# Altium schematic sheet BoardB-FPGA3.SchDoc
size A; SheetNumber: 5; SheetTotal: 9
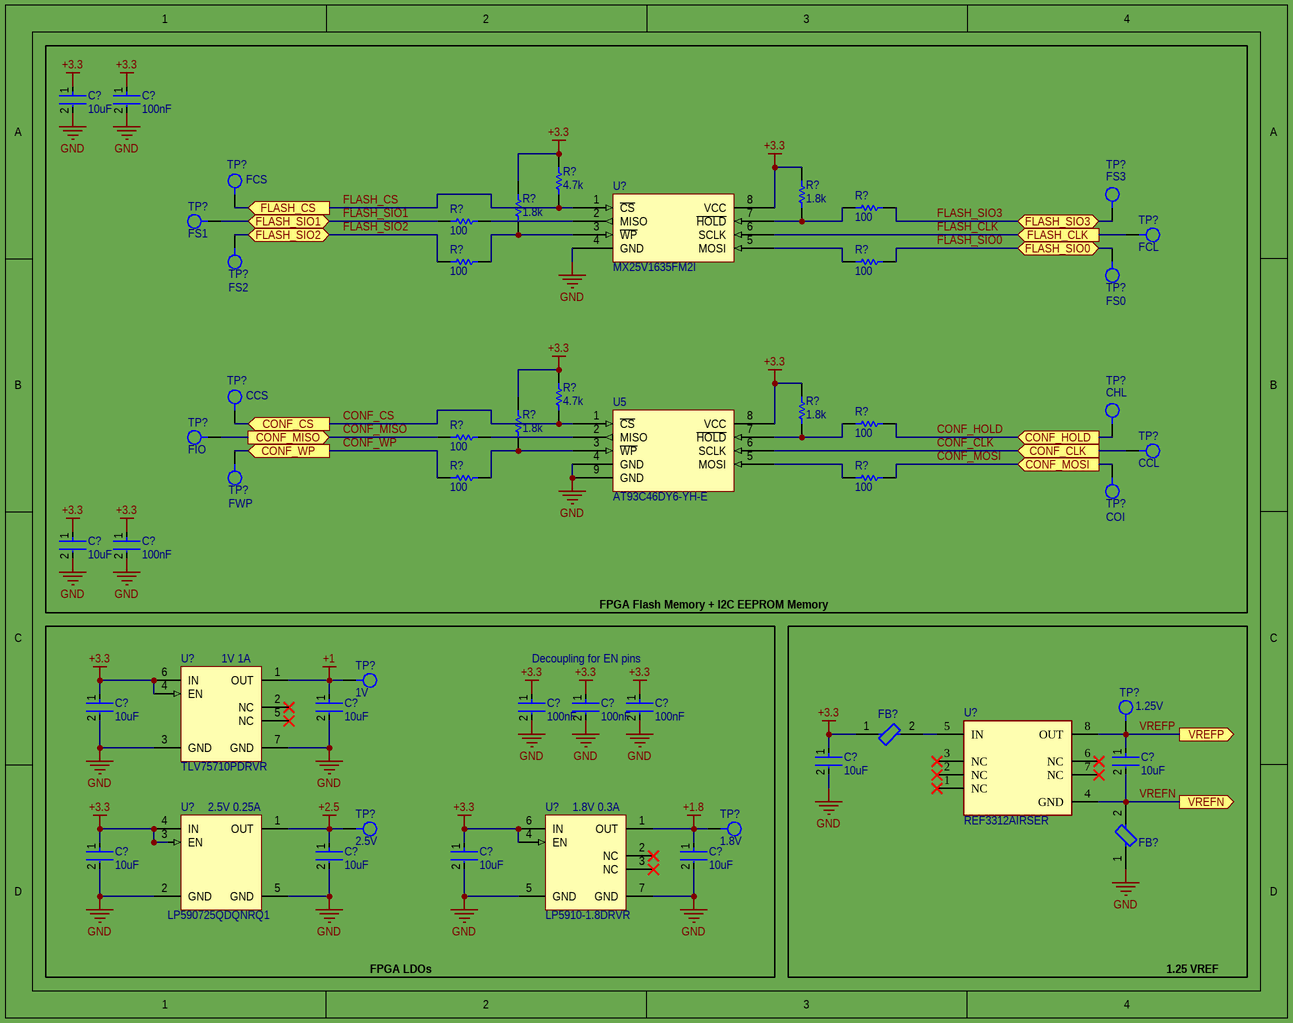
[diagram p0: BoardB-FPGA3.SchDoc]

## Parts
(Parts that share a designator on the sheet are numbered #1, #2 ... from top to bottom, then left to right.)
C?#1  10uF  [FP-GRM188-0_1-e0_2_0_55-IPC_A]
C?#2  100nF  [FP-CGA3E-0_3-0_1-IPC_A]
C?#3  10uF  [FP-GRM188-0_1-e0_2_0_55-IPC_A]
C?#4  100nF  [FP-CGA3E-0_3-0_1-IPC_A]
C?#5  10uF  [FP-GRM188-0_1-e0_2_0_55-IPC_A]
C?#6  10uF  [FP-GRM188-0_1-e0_2_0_55-IPC_A]
C?#7  100nF  [FP-CGA3E-0_3-0_1-IPC_A]
C?#8  100nF  [FP-CGA3E-0_3-0_1-IPC_A]
C?#9  100nF  [FP-CGA3E-0_3-0_1-IPC_A]
C?#10  10uF  [FP-GRM188-0_1-e0_2_0_55-IPC_A]
C?#11  10uF  [FP-GRM188-0_1-e0_2_0_55-IPC_A]
C?#12  10uF  [FP-GRM188-0_1-e0_2_0_55-IPC_A]
C?#13  10uF  [FP-GRM188-0_1-e0_2_0_55-IPC_A]
C?#14  10uF  [FP-GRM188-0_1-e0_2_0_55-IPC_A]
C?#15  10uF  [FP-GRM188-0_1-e0_2_0_55-IPC_A]
FB?#1  BLM18AG601SN1D  [FP-BLM18-0_15-t0_8-MFG]  (value not drawn)
FB?#2  BLM18AG601SN1D  [FP-BLM18-0_15-t0_8-MFG]  (value not drawn)
R?#1  4.7k  [RESC1005X40X25ML05T05]
R?#2  100  [RESC0603X26X15ML03T05]
R?#3  100  [RESC0603X26X15ML03T05]
R?#4  1.8k  [RESC1005X40X25LL05T05]
R?#5  1.8k  [RESC1005X40X25LL05T05]
R?#6  100  [RESC0603X26X15ML03T05]
R?#7  100  [RESC0603X26X15ML03T05]
R?#8  4.7k  [RESC1005X40X25ML05T05]
R?#9  100  [RESC0603X26X15ML03T05]
R?#10  100  [RESC0603X26X15ML03T05]
R?#11  1.8k  [RESC1005X40X25LL05T05]
R?#12  1.8k  [RESC1005X40X25LL05T05]
R?#13  100  [RESC0603X26X15ML03T05]
R?#14  100  [RESC0603X26X15ML03T05]
TP?#1  FCS
TP?#2  FS1
TP?#3  FS3
TP?#4  FS2
TP?#5  FCL
TP?#6  FS0
TP?#7  CCS
TP?#8  FIO
TP?#9  CHL
TP?#10  FWP
TP?#11  CCL
TP?#12  COI
TP?#13  1V
TP?#14  1.25V
TP?#15  2.5V
TP?#16  1.8V
U5  AT93C46DY6-YH-E  [AT93C46DY6-YH-E]
U?#1  MX25V1635FM2I
U?#2  TLV75710PDRVR
U?#3  REF3312AIRSER  [FP-RSE0008A-MFG]
U?#4  LP590725QDQNRQ1  [LP5907]
U?#5  LP5910-1.8DRVR  [LP5910]

## Blocks framed on the sheet
FPGA Flash Memory + I2C EEPROM Memory: C?#1-C?#4 R?#1-R?#14 TP?#1-TP?#12 U5 U?#1
1.25 VREF: C?#10 C?#11 FB?#1 FB?#2 TP?#14 U?#3

## Ports
CONF_CLK (in), CONF_CS (in), CONF_HOLD (in), CONF_MISO (out), CONF_MOSI (in), CONF_WP (in), FLASH_CLK (in), FLASH_CS (in), FLASH_SIO0 (bidir), FLASH_SIO1 (bidir), FLASH_SIO2 (bidir), FLASH_SIO3 (bidir), VREFN (out), VREFP (out)

## Nets
+1: C?#6.1 TP?#13.1 U?#2.1(OUT)
+1.8: C?#15.1 TP?#16.1 U?#5.1(OUT)
+2.5: C?#13.1 TP?#15.1 U?#4.1(OUT)
+3.3: C?#1.1 C?#2.1 C?#3.1 C?#4.1 C?#5.1 C?#7.1 C?#8.1 C?#9.1 C?#10.1 C?#12.1 C?#14.1 FB?#1.1 R?#1.2 R?#4.2 R?#5.2 R?#8.2 R?#11.2 R?#12.2 U5.8(VCC) U?#1.8(VCC) U?#2.4(EN) U?#2.6(IN) U?#4.3(EN) U?#4.4(IN) U?#5.4(EN) U?#5.6(IN)
GND: C?#1.2 C?#2.2 C?#3.2 C?#4.2 C?#5.2 C?#6.2 C?#7.2 C?#8.2 C?#9.2 C?#10.2 C?#12.2 C?#13.2 C?#14.2 C?#15.2 FB?#2.1 U5.4(GND) U5.9(GND) U?#1.4(GND) U?#2.3(GND) U?#2.7(GND) U?#4.2(GND) U?#4.5(GND) U?#5.5(GND) U?#5.7(GND)
CONF_CLK: TP?#11.1 U5.6(SCLK) ; port CONF_CLK
CONF_CS: R?#8.1 TP?#7.1 U5.1(~{CS}) ; port CONF_CS
CONF_HOLD: R?#9.2 TP?#9.1 ; port CONF_HOLD
CONF_MISO: R?#10.1 TP?#8.1 ; port CONF_MISO
CONF_MOSI: R?#14.2 TP?#12.1 ; port CONF_MOSI
CONF_WP: R?#13.1 TP?#10.1 ; port CONF_WP
FLASH_CLK: TP?#5.1 U?#1.6(SCLK) ; port FLASH_CLK
FLASH_CS: R?#1.1 TP?#1.1 U?#1.1(~{CS}) ; port FLASH_CS
FLASH_SIO0: R?#7.2 TP?#6.1 ; port FLASH_SIO0
FLASH_SIO1: R?#3.1 TP?#2.1 ; port FLASH_SIO1
FLASH_SIO2: R?#6.1 TP?#4.1 ; port FLASH_SIO2
FLASH_SIO3: R?#2.2 TP?#3.1 ; port FLASH_SIO3
VREFN: C?#11.2 FB?#2.2 U?#3.4(GND) ; port VREFN
VREFP: C?#11.1 TP?#14.1 U?#3.8(OUT) ; port VREFP
NetFB?#1_2: FB?#1.2 U?#3.5(IN)
NetR?#2_1: R?#2.1 R?#4.1 U?#1.7(~{HOLD})
NetR?#3_2: R?#3.2 U?#1.2(MISO)
NetR?#5_1: R?#5.1 R?#6.2 U?#1.3(~{WP})
NetR?#7_1: R?#7.1 U?#1.5(MOSI)
NetR?#9_1: R?#9.1 R?#11.1 U5.7(~{HOLD})
NetR?#10_2: R?#10.2 U5.2(MISO)
NetR?#12_1: R?#12.1 R?#13.2 U5.3(~{WP})
NetR?#14_1: R?#14.1 U5.5(MOSI)

Not connected (* = marked no-connect by the designer): U?#2 2(NC)* 5(NC)*; U?#3 1(NC)* 2(NC)* 3(NC)* 6(NC)* 7(NC)*; U?#5 2(NC)* 3(NC)*

## Notes on the sheet
- (near U?#2) 1V 1A
- (near C?#9) Decoupling for EN pins
- (near U?#4) 2.5V 0.25A
- (near U?#5) 1.8V 0.3A
- FPGA LDOs

## Library data of the parts
C?#1 C?#3 C?#5 C?#6 C?#10-C?#15 = CMP-2006-02792-2: Chip Multilayer Ceramic Capacitors for General Purpose, 0603, 10uF, X5R, 15%, 20%, 6.3V; Packaging: Tape and Reel; Voltage Rating (DC): 6.3V; Width: 0.031inch; Termination: SMD/SMT; Dielectric: X5R; Package Quantity: 4000; Voltage Rating: 6.3V; Capacitance: 10uF; Case/Package: 0603; Min Operating Temperature: -55°C; Voltage: 6.3V; Length: 1.6mm; Thickness: 0.035inch; Lead Free: Lead Free; Depth: 0.8mm; Case Code (Imperial): 0603; Max Operating Temperature: 85°C; Material: Ceramic; Height: 0.8mm; Tolerance: 20%; Mount: Surface Mount; REACH SVHC: No SVHC; Radiation Hardening: No; Case Code (Metric): 1608
C?#2 C?#4 C?#7-C?#9 = CMP-2000-07546-2: Cap Ceramic 100nF 50V X7R 10% Pad SMD 0603 +125°C Automotive T/R; Weight: 7.1E-05oz; Composition: Ceramic; Max Operating Temperature: 125°C; Termination: SMD/SMT; Dielectric: X7R; Length: 1.6mm; Package Quantity: 1; REACH SVHC: No SVHC; Lead Free: Lead Free; Case Code (Metric): 1608; Min Operating Temperature: -55°C; Packaging: Tape and Reel; Tolerance: 10%; Voltage Rating: 50V; Case Code (Imperial): 0603; Capacitance: 100nF; Case/Package: 0603; Voltage Rating (DC): 50V; Depth: 0.8mm; Radiation Hardening: No; Ratings: AEC-Q200; Mount: Surface Mount; Voltage: 50V; Thickness: 0.035inch; Width: 0.8mm; Height: 0.8mm
FB?#1 FB?#2 = CMP-0686-00436-3: Chip Ferrite Bead, 0603, 600Ω @ 100MHz, 0.38Ω, 25%, 500mA; Number of Lines: 1; Impedance: 600R; DC Resistance (DCR): 380mR; Material: Steel; Shielding: Unshielded; Max DC Current: 500mA; Termination: SMD/SMT; Military Standard: Not; Number of Circuits: 1; Min Operating Temperature: -55°C; Case Code (Imperial): 0603; Width: 0.8mm; Current Rating: 500mA; Lead Free: Lead Free; Packaging: Tape and Reel; Frequency: 100MHz; Max Operating Temperature: 125°C; DC Current: 500mA; REACH SVHC: No SVHC; Case/Package: 0603; Package Quantity: 1; Height: 0.8mm; Number of Pins: 2; Depth: 0.8mm; Test Frequency: 100MHz; Case Code (Metric): 1608; Tolerance: 25%; Core Material: Ferrite; Weight: 7.1E-05oz; Max Current Rating: 500mA; Radiation Hardening: No; Length: 1.6mm; RoHS Compliant: Yes
R?#1 R?#8 = CMP-2002-01154-4: Chip Resistor, 4.7 KOhm, +/- 1%, 0.1 W, -55 to 155 degC, 0402 (1005 Metric), RoHS, Tape and Reel; PartNumber: ERJ-2RKF4701X; Voltage Rating: 50 V; Case\/Package: 0402; Power Rating: 100 mW; Height: 0.35 mm; Mounting Technology: Surface Mount; REACH SVHC: Yes; Resistance: 4.7 KOhm; Max Operating Temperature: 155 degC; ComponentLink1Description: Manufacturer URL; ComponentLink2Description: Datasheet; Pins: 2; PackageReference: 0402; Tolerance: 1%; Case Code (Imperial): 0402; Length: 1 mm; PackageDescription: 2-Pin Surface Mount Device, Body 1 x 0.5 mm; RoHSCompliant: true; Package Quantity: 1; Radiation Hardening: No; DatasheetVersion: 04/2015; Width: 0.5 mm; Case Code (Metric): 1005; Mount: Surface Mount; ComponentLink1URL: http://www.panasonic.com/; Min Operating Temperature: -55 degC; Packaging: Cut Tape; ComponentLink2URL: http://industrial.panasonic.com/cdbs/www-data/pdf/RDA0000/AOA0000C86.pdf
R?#2 R?#3 R?#6 R?#7 R?#9 R?#10 R?#13 R?#14 = CMP-2004-03565-1: Manufacturer: TE Connectivity / AMP; Part Number: CRG0201F100R
R?#4 R?#5 R?#11 R?#12 = CMP-2002-01128-1: Manufacturer: Panasonic; Part Number: ERJ2RKF1801X
TP?#1-TP?#16 = TestPoint1mm
U5 = AT93C46DY6-YH-E: EEPROM Memory IC 1Kb (128 x 8, 64 x 16) SPI 8-UDFN (2x3); Manufacturer: Microchip; Manufacturer Part Number: AT25040B-MAHL-E; RoHS: Yes; Supplier 1: Digi-Key; Supplier Part Number 1: AT93C46DY6-YH-ECT-ND
U?#1 = MX25V1635FM2I: IC FLASH 16M SPI 80MHZ 8SOP; Manufacturer: Macronix; Memory Type: FLASH,NOR; Interface: SPI,Serial; Supplier 1: Digi-Key; Manufacturer Part Number: MX25V1635FM2I; RoHS: Yes; Category: Memory; Stock 1: 14366; Pricing 1: 1=0.71000, 10=0.64700, 25=0.63880, 50=0.63480, 100=0.56770, 250=0.56288, 500=0.55456, 1000=0.53472, 5000=0.48704 (USD); Case/Package: SOIC; Min Operating Temperature: -40°C; Max Operating Temperature: 85°C; Packaging: Rail/Tube; Frequency: 80MHz; Lead Free: Lead Free; RoHS Compliant: Yes; ComponentLink1URL: http://ckassoc.com/oldsite/pdf/Macronix_Product_Line_Card_July_2017_General%20_070617.pdf?src-supplier=Digi-Key; ComponentLink1Description: http://ckassoc.com/oldsite/pdf/Macronix_Product_Line_Card_July_2017_General%20_070617.pdf?src-supplier=Digi-Key; Supplier Part Number 1: 1092-1189-ND
U?#2 = TLV75710PDRVR: 1-A low-IQ small-size low-dropout (LDO) regulator 6-WSON -40 to 125; Manufacturer Part Number: LP5910-1.0DRVR; Manufacturer: Texas Instruments; Output Voltage: 1V; Output Current: 300mA; Number of Regulators: 1; Quiescent Current: 12uA; Dropout Voltage: 120mV; Output Type: Fixed; Output Configuration: Positive; Max Input Voltage: 5.5V; Max Supply Current: 40uA; Power Supply Rejection Ratio (PSRR): 52dB; RoHS: Yes; Stock 1: 2189; Pricing 1: 1=0.63000, 10=0.53700, 50=0.53700, 100=0.37200, 1000=0.24400, 10000=0.19500 (USD); Mount: Surface Mount; Min Operating Temperature: -40°C; Max Operating Temperature: 125°C; Packaging: Tape and Reel; Lead Free: Lead Free; RoHS Compliant: Yes; ComponentLink1URL: http://www.ti.com/lit/ds/symlink/lp5910.pdf?src-supplier=Digi-Key; ComponentLink1Description: http://www.ti.com/lit/ds/symlink/lp5910.pdf?src-supplier=Digi-Key; ComponentLink2URL: http://www.ti.com/general/docs/suppproductinfo.tsp?distId=10&amp;gotoUrl=http%3A%2F%2Fwww.ti.com%2Flit%2Fgpn%2Flp5910&src-supplier=Digi-Key; ComponentLink2Description: http://www.ti.com/general/docs/suppproductinfo.tsp?distId=10&amp;gotoUrl=http%3A%2F%2Fwww.ti.com%2Flit%2Fgpn%2Flp5910&src-supplier=Digi-Key; Category: Voltage Regulators - Linear; Stock 2: 1477; Pricing 2: 1=0.61000, 10=0.53900, 25=0.50600, 100=0.41300, 250=0.38360, 500=0.32648, 1000=0.26950 (USD); Min Output Voltage: 1V; ComponentLink3URL: http://www.ti.com/lit/ds/symlink/tlv757p.pdf?src-supplier=Digi-Key; ComponentLink3Description: http://www.ti.com/lit/ds/symlink/tlv757p.pdf?src-supplier=Digi-Key; Supplier 1: Digi-Key; Supplier Part Number 1: 296-50004-1-ND
U?#3 = CMP-04916-000026-1: IC VREF SERIES 0.15% 8UQFN; Output Current: 5mA; Operating Supply Current: 8.5uA; Temperature Coefficient: 30ppm/°C; Output Type: Fixed; Min Output Voltage: 1.25V; Tolerance: 0.15%; Min Operating Temperature: -40°C; Max Operating Temperature: 125°C; RoHS Compliant: Yes; Reference Type: Series; Number of Pins: 8; Mount: Surface Mount; Packaging: Tape and Reel
U?#4 = LP590725QDQNRQ1: LDO Regulator Pos 1.2V to 4.5V 0.25A 4-Pin X2SON EP T/R; Manufacturer: Texas Instruments; Supplier 1: Digi-Key; RoHS: Yes; Stock 1: 2810; Pricing 1: 1=0.64000, 10=0.56000, 25=0.52560, 100=0.42910, 250=0.39856, 500=0.33920, 1000=0.28000 (USD); Manufacturer Part Number: LP590725QDQNRQ1; Supplier Part Number 1: 296-LP590725QDQNRQ1CT-ND; Category: Integrated Circuits (ICs)
U?#5 = LP5910-1.8DRVR: IC REG LINEAR 1.8V 300MA 6SON; Manufacturer: Texas Instruments; Dropout Voltage: 145mV; Number of Regulators: 1; Quiescent Current: 12uA; Supplier 1: Digi-Key; RoHS: Yes; Stock 1: 556; Pricing 1: 1=0.63000, 10=0.53700, 25=0.50080, 100=0.40070, 250=0.37208, 500=0.31482, 1000=0.24327 (USD); Mount: Surface Mount; Min Operating Temperature: -40°C; Max Operating Temperature: 125°C; Packaging: Tape and Reel; Output Voltage: 1.8V; Output Current: 300mA; Lead Free: Lead Free; RoHS Compliant: Yes; ComponentLink1URL: http://www.ti.com/general/docs/suppproductinfo.tsp?distId=10&amp;gotoUrl=http%3A%2F%2Fwww.ti.com%2Flit%2Fgpn%2Flp5910&src-supplier=Digi-Key; ComponentLink1Description: http://www.ti.com/general/docs/suppproductinfo.tsp?distId=10&amp;gotoUrl=http%3A%2F%2Fwww.ti.com%2Flit%2Fgpn%2Flp5910&src-supplier=Digi-Key; ComponentLink2URL: http://www.ti.com/lit/ds/symlink/lp5910.pdf?src-supplier=Digi-Key; ComponentLink2Description: http://www.ti.com/lit/ds/symlink/lp5910.pdf?src-supplier=Digi-Key; Manufacturer Part Number: LP5910-1.8DRVR; Supplier Part Number 1: 296-47212-1-ND; Category: Voltage Regulators - Linear